# EAGLE design Shield_Grove_I2C (EAGLE 9.4.0)
COMPANY: Unexpected Maker; DATE: 24-10-2018; DRAWN: Seon; REV: V1; TITLE: TinyPICO
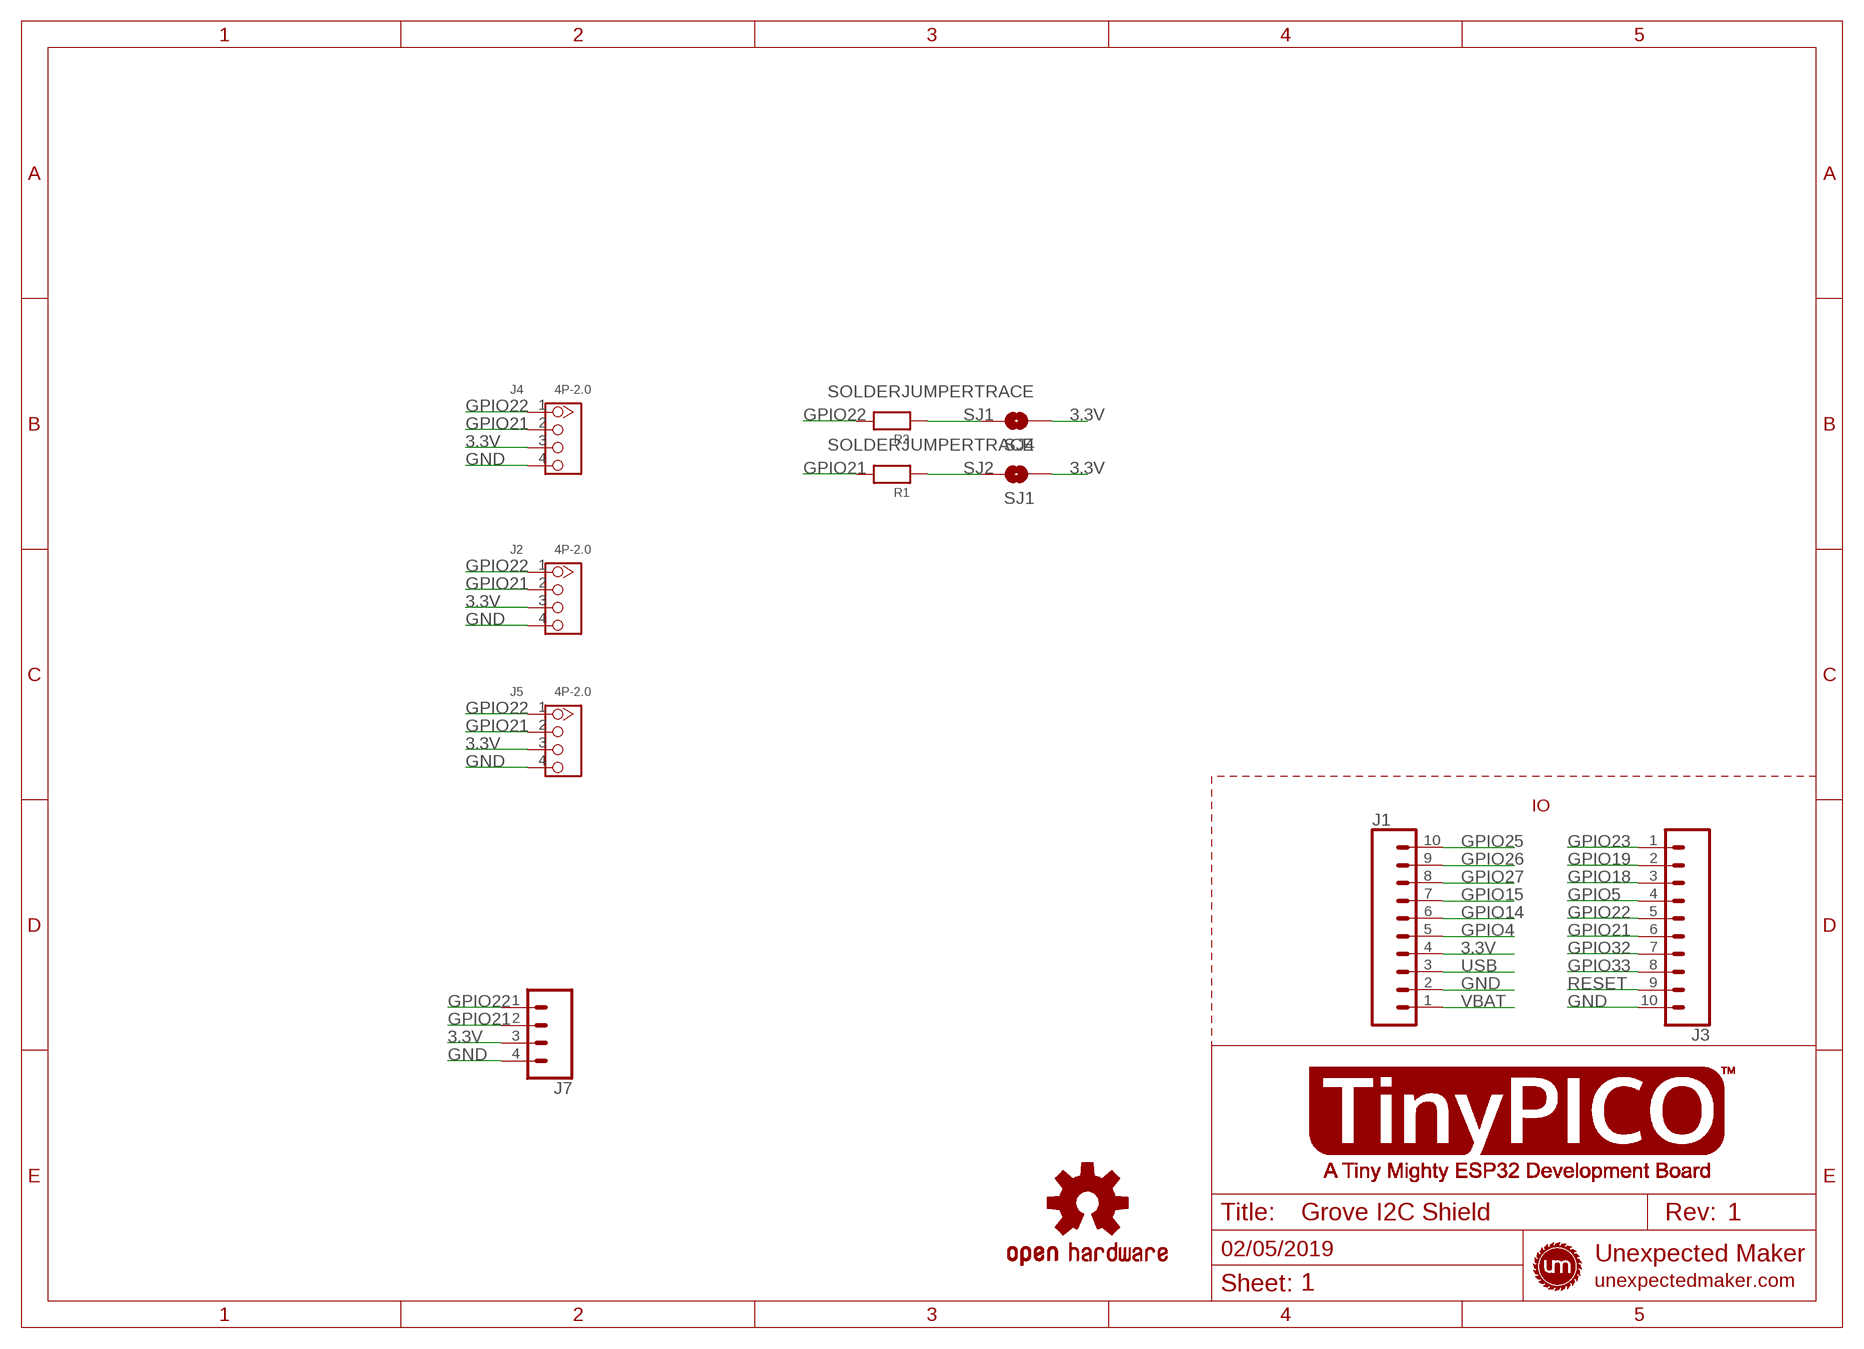
[diagram p0: schematic, sheet 1]
FRAME2 (FRAME_A4_TINYPICO): CDATE: 02/05/2019; REV: 1; SHEET_NUM: 1; TITLE: Grove I2C Shield

## Parts
J1  TINYPICO_HEADER_10NO_SILK_PTH_FEMALE  [1X10_NO_SILK]
J2  4P-2.0  GROVE-CONNECTOR-DIP(4P-2.0)  [HW4-2.0]
J3  TINYPICO_HEADER_10NO_SILK_PTH_FEMALE  [1X10_NO_SILK]
J4  4P-2.0  GROVE-CONNECTOR-DIP(4P-2.0)  [HW4-2.0]
J5  4P-2.0  GROVE-CONNECTOR-DIP(4P-2.0)  [HW4-2.0]
J7  CONN_041X04_NO_SILK  [1X04_NO_SILK]
LOGO1  OSHW-LOGOS  [OSHW-LOGO-S]
R1  RESISTOR_0603MP  [_0603MP]
R2  RESISTOR_0603MP  [_0603MP]
SJ1  SOLDERJUMPERTRACE  [SPARKFUN_SJ_2S-TRACE]
SJ4  SOLDERJUMPERTRACE  [SPARKFUN_SJ_2S-TRACE]

## Nets
3.3V: J1.4 J2.3 J4.3 J5.3 J7.3 SJ1.1 SJ4.1
GND: J1.2 J2.4 J3.10 J4.4 J5.4 J7.4
GPIO4: J1.5
GPIO5: J3.4
GPIO14: J1.6
GPIO15: J1.7
GPIO18: J3.3
GPIO19: J3.2
GPIO21: J2.2 J3.6 J4.2 J5.2 J7.2 R1.2
GPIO22: J2.1 J3.5 J4.1 J5.1 J7.1 R2.2
GPIO23: J3.1
GPIO25: J1.10
GPIO26: J1.9
GPIO27: J1.8
GPIO32: J3.7
GPIO33: J3.8
RESET: J3.9
SJ1: R2.1 SJ4.2
SJ2: R1.1 SJ1.2
USB: J1.3
VBAT: J1.1

## Notes on the sheet
- IO

## Library data of the parts
J1 J3 = UnexpectedMaker:TINYPICO_HEADER_10: Multi connection point. Often used as Generic Header-pin footprint for 0.1 inch spaced/style header connections On any of the 0.1 inch spaced packages, you can populate with these: Break Away Headers - Straight <https://www.sparkfun.com/products/116> (PRT-00116) Break Away Male Headers - Right Angle <https://www.sparkfun.com/products/553> (PRT-00553) Female Headers <https://www.sparkfun.com/products/115> (PRT-00115) Break Away Headers - Machine Pin <https://www.sparkfun.com/products/117> (PRT-00117) Break Away Female Headers - Swiss Machine Pin <https://www.sparkfun.com/products/743> (PRT-00743) Arduino Stackable Header - 10 Pin <https://www.sparkfun.com/products/11376> (PRT-11376) For SCREWTERMINALS and SPRING TERMINALS visit here: Screw Terimnals on SparkFun.com <https://www.sparkfun.com/search/results?term=Screw+Terminals> (5mm/3.5mm/2.54mm spacing) This device is also useful as a general connection point to wire up your design to another part of your project. Our various solder wires solder well into these plated through hole pads. Hook-Up Wire - Assortment (Stranded, 22 AWG) <https://www.sparkfun.com/products/11375> (PRT-11375) Hook-Up Wire - Assortment (Solid Core, 22 AWG) <https://www.sparkfun.com/products/11367> (PRT-11367) View the entire wire category on our website here <https://www.sparkfun.com/categories/141> Special notes: Molex polarized connector foot print use with SKU : PRT-08231 with associated crimp pins and housings. 1MM SMD Version SKU: PRT-10208 NOTES ON THE VARIANTS LOCK and LOCK_LONGPADS... This footprint was designed to help hold the alignment of a through-hole component (i.e. 6-pin header) while soldering it into place. You may notice that each hole has been shifted either up or down by 0.005 of an inch from it's more standard position (which is a perfectly straight line). This slight alteration caused the pins (the squares in the middle) to touch the edges of the holes. Because they are alternating, it causes a "brace" to hold the component in place. 0.005 has proven to be the perfect amount of "off-center" position when using our standard breakaway headers. Although looks a little odd when you look at the bare footprint, once you have a header in there, the alteration is very hard to notice. Also,if you push a header all the way into place, it is covered up entirely on the bottom side.; PROD_ID: CONN-11563
J2 J4 J5 = Seeed-Connector:GROVE-CONNECTOR-DIP(4P-2.0): 320110033
J7 = SparkFun-Connectors:CONN_04: Multi connection point. Often used as Generic Header-pin footprint for 0.1 inch spaced/style header connections On any of the 0.1 inch spaced packages, you can populate with these: Break Away Headers - Straight <https://www.sparkfun.com/products/116> (PRT-00116) Break Away Male Headers - Right Angle <https://www.sparkfun.com/products/553> (PRT-00553) Female Headers <https://www.sparkfun.com/products/115> (PRT-00115) Break Away Headers - Machine Pin <https://www.sparkfun.com/products/117> (PRT-00117) Break Away Female Headers - Swiss Machine Pin <https://www.sparkfun.com/products/743> (PRT-00743) For SCREWTERMINALS and SPRING TERMINALS visit here: Screw Terimnals on SparkFun.com <https://www.sparkfun.com/search/results?term=Screw+Terminals> (5mm/3.5mm/2.54mm spacing) This device is also useful as a general connection point to wire up your design to another part of your project. Our various solder wires solder well into these plated through hole pads. Hook-Up Wire - Assortment (Stranded, 22 AWG) <https://www.sparkfun.com/products/11375> (PRT-11375) Hook-Up Wire - Assortment (Solid Core, 22 AWG) <https://www.sparkfun.com/products/11367> (PRT-11367) View the entire wire category on our website here <https://www.sparkfun.com/categories/141> Special notes: Molex polarized connector foot print use with SKU : PRT-08231 with associated crimp pins and housings. 1MM SMD Version SKU: PRT-10208; PROD_ID: CONN-09696
LOGO1 = SparkFun-Aesthetics:OSHW-LOGO: Open-Source Hardware (OSHW) Logo This logo indicates the piece of hardware it is found on incorporates a OSHW license and/or adheres to the definition of open source hardware found here: http://freedomdefined.org/OSHW
R1 R2 = microbuilder:RESISTOR: Resistors 0402 - 0402 Surface Mount Package 22 Ohm 1% 1/16W [Digikey: 311-22.0LRTR-ND] 33 Ohm 5% 1/16W 1.0K 5% 1/16W 1.5K 5% 1/16W 2.0K 1% 1/16W 10.0K 1% 1/16W [Digikey: 311-10.0KLRTR-ND] 10.0K 5% 1/16W [Digikey: RMCF0402JT10K0TR-ND] 12.1K 1% 1/16W [Digikey: 311-22.0LRTR-ND] 100.0K 5% 1/16W 0603 - 0603 Surface Mount Package 0 Ohm 1/10 Watt 1% Resistor 15 Ohm 1/10 Watt 1% Resistor 33 Ohm 1/10 Watt 1% Resistor 49.9 Ohm 1/10 Watt 1% Resistor 100 Ohm 1/10 Watt 1% Resistor 150 Ohm 1/10 Watt 1% Resistor 240 Ohm 1/10 Watt 1% Resistor 390 Ohm 1/10 Watt 1% Resistor 560 Ohm 1/10 Watt 1% Resistor 680 Ohm 1/10 Watt 1% Resistor 750 Ohm 1/10 Watt 1% Resistor 1.0K Ohm 1/10 Watt 1% Resistor 1.5K Ohm 1/10 Watt 1% Resistor 2.0K Ohm 1/10 Watt 1% Resistor 2.2K Ohm 1/10 Watt 1% Resistor 3.3K Ohm 1/10 Watt 1% Resistor 4.7K Ohm 1/10 Watt 1% Resistor 10.0K Ohm 1/10 Watt 1% Resistor 12.0K Ohm 1/10 Watt 1% Resistor 12.1K Ohm 1/10 Watt 1% Resistor 20.0K Ohm 1/10 Watt 1% Resistor 33.0K Ohm 1/10 Watt 1% Resistor 100.0K Ohm 1/10 Watt 1% Resistor 0805 - 0805 Surface Mount Package 0 Ohm 1/8 Watt 1% Resistor 33 Ohm 1/8 Watt 1% Resistor 100 Ohm 1/8 Watt 1% Resistor 150 Ohm 1/8 Watt 1% Resistor 200 Ohm 1/8 Watt 1% Resistor 240 Ohm 1/8 Watt 1% Resistor 330 Ohm 1/8 Watt 1% Resistor 390 Ohm 1/8 Watt 1% Resistor 470 Ohm 1/8 Watt 1% Resistor 1.0K Ohm 1/8 Watt 1% Resistor 1.5K Ohm 1/8 Watt 1% Resistor 2.0K Ohm 1/8 Watt 1% Resistor 4.7K Ohm 1/8 Watt 1% Resistor 5.1K Ohm 1/8 Watt 1% Resistor 5.6K Ohm 1/8 Watt 1% Resistor 10.0K Ohm 1/8 Watt 1% Resistor 22.0K Ohm 1/8 Watt 1% Resistor 33.0K Ohm 1/8 Watt 1% Resistor 100K Ohm 1/8 Watt 1% Resistor 1206 - 1206 Surface Mount Package 2012 - 2010 Surface Mount Package 0.11 Ohm 1/2 Watt 1% Resistor - Digikey: RHM.11UCT-ND
SJ1 SJ4 = UnexpectedMaker:SOLDERJUMPER: Solder Jumper Standard SMD solder jumper. Used to automate production. Two varients : Normally Open and Normally Closed are the same, but have different paste layers. NC will have a large amount of paste and should jumper during reflow.

## Board
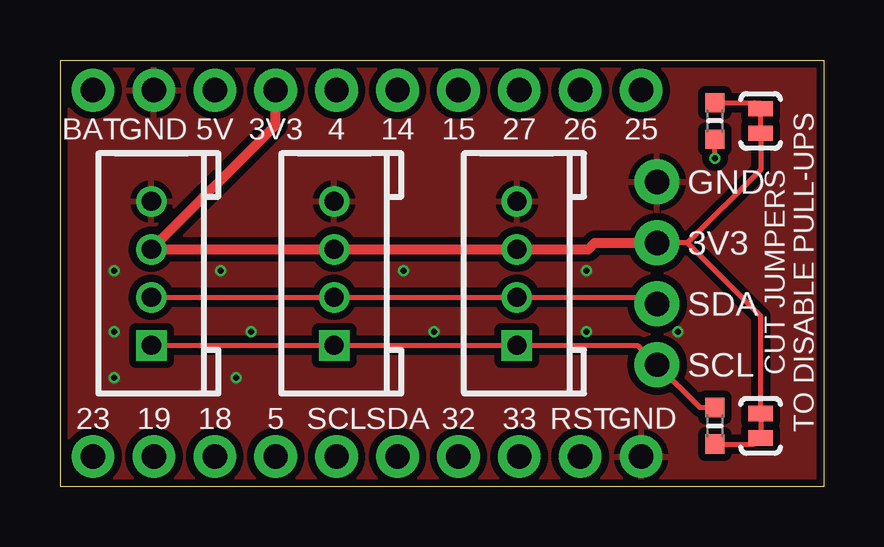
[diagram p1: board, top side]
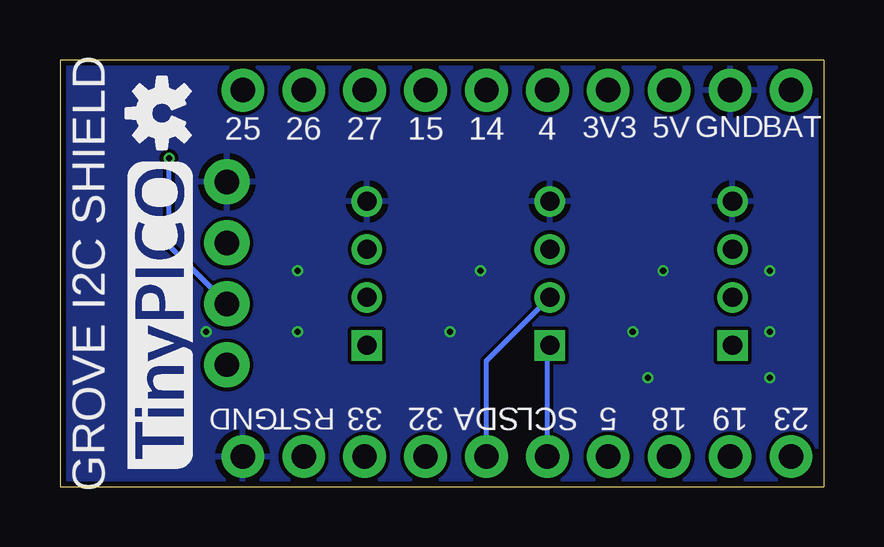
[diagram p2: board, bottom side, seen from below]

Size 31.85 x 17.78 mm. Coordinates in mm from the lower left corner, seen from the top.
Outline: 31.85,0 0,0 0,17.78 31.85,17.78 31.85,0
Copper layers (1*16): Top 0.035mm / dielectric 1.5mm / Bottom 0.035mm
Design rules "UnexpectedMaker_JLCPCB 2 Layer": minimum track width 6mil, minimum drill 10mil, track to track 6mil, track to pad 6mil, pad to pad 6mil, via to via 6mil, smd to smd 6mil, copper to edge 9mil, drill to drill 7mil, minimum pad ring 4mil, minimum via ring 4mil, stop-mask expansion 4mil, vias tented up to drill 25mil, thermal gap 10mil

### Footprints (pad centres in the part's own frame; a part is rotated, then mirrored left to right if it is on the bottom)
1X10_NO_SILK = drill 1.016 pad 1.778: 1 0,0; 2 2.54,0; 3 5.08,0; 4 7.62,0; 5 10.16,0; 6 12.7,0; 7 15.24,0; 8 17.78,0; 9 20.32,0; 10 22.86,0
HW4-2.0 = drill 0.8 pad 1.27 square: 1 -3,0 | drill 0.8 pad 1.27: 2 -1,0; 3 1,0; 4 3,0
1X04_NO_SILK = drill 1.016 pad 1.88: 1 0,0; 2 2.54,0; 3 5.08,0; 4 7.62,0
_0603MP = smd 0.8 x 0.8: 1 -0.762,0; 2 0.762,0
SPARKFUN_SJ_2S-TRACE = smd 0.635 x 1.016: 1 -0.508,0; 2 0.508,0

### Placement (x,y rotation side)
J1  1.37,16.52 0 top
J2  11.43,8.89 90 top
J3  1.37,1.26 0 top
J4  3.81,8.89 90 top
J5  19.05,8.89 90 top
J7  24.89,5.08 90 top
LOGO1  27.6,15.56 90 bottom
R1  27.3,15.24 270 top
R2  27.3,2.54 90 top
SJ1  29.21,15.24 90 top
SJ4  29.21,2.54 270 top

### Tracks (layer width: path | path; a pad name or v marks a point on that pad's centre or on a via)
3.3V
  Top 0.203: 26.16,10.16 29.21,7.11 SJ4.1 | SJ1.1 29.21,13.21 26.16,10.16 | 26.16,10.16 J7.3
  Top 0.406: J1.4 8.99,15.07 J4.3 J2.3 J5.3 22.03,9.89 22.3,10.16 J7.3
GND  (via drill 0.25)
  other vias: 2.26,4.55 7.34,4.55 2.26,6.45 2.26,8.99 6.71,8.99 14.33,8.99 21.95,8.99 21.95,6.45 25.76,6.45 15.6,6.45 7.98,6.45
  pour Top (isolate 0.305): -0.85,18.1 -0.85,-0.33 32.17,-0.33 32.17,18.08 -0.84,18.08
  pour Bottom: 32.38,18.41 32.38,-0.64 -1.27,-0.64 -1.27,18.41
GPIO21  (via drill 0.25)
  Top 0.203: J4.2 J2.2 J5.2 24.62,7.89 J7.2 | v27.3,13.69 R1.2
  Bottom 0.203: J3.6 14.07,5.25 J2.2 | J7.2 27.3,10.03 v27.3,13.69
GPIO22
  Top 0.203: J4.1 J2.1 J5.1 24.08,5.89 J7.1 26.67,3.3 R2.2
  Bottom 0.203: J3.5 11.53,5.79 J2.1
SJ1
  Top 0.203: R2.1 28.96,1.78 28.98,1.8 29.21,1.8 SJ4.2
SJ2
  Top 0.203: R1.1 28.96,16 28.98,15.98 29.21,15.98 SJ1.2

### Text on the board
bPlace: GROVE I2C SHIELD
tNames: BAT | GND | 5V | 3V3 | 4 | 14 | 15 | 27 | 26 | 25 | GND | 3V3 | CUT JUMPERS / TO DISABLE PULL-UPS | SDA | SCL | 23 | 19 | 18 | 5 | SCL | SDA | 32 | 33 | RST | GND
bNames: BAT | GND | 5V | 3V3 | 4 | 14 | 15 | 27 | 26 | 25 | RST | GND | 23 | 19 | 18 | 5 | SCL | SDA | 32 | 33